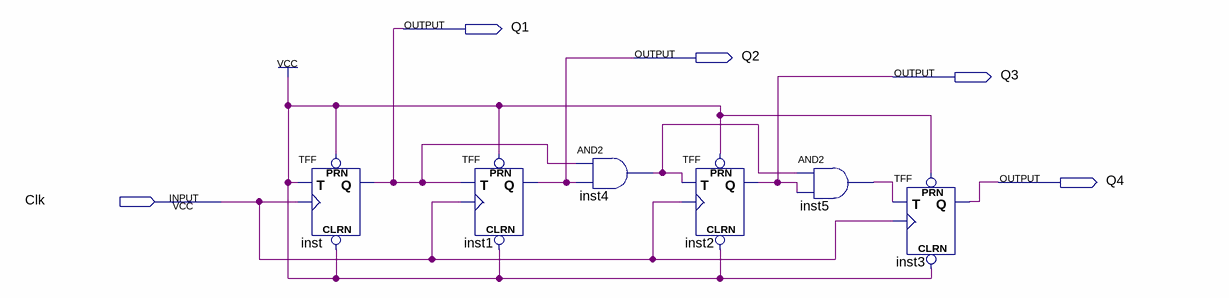
[diagram p0: schematic sheet]
// Quartus schematic lab10step2b.bdf as structural Verilog: 6 symbols, 5 pins
module lab10step2b (
  input  Clk,
  output Q1,
  output Q2,
  output Q3,
  output Q4
);

  wire inst4_out, inst5_out;

  TFF inst (.PRN(1'b1), .CLRN(1'b1), .T(1'b1), .CLK(Clk), .Q(Q1));
  TFF inst1 (.PRN(1'b1), .CLRN(1'b1), .T(Q1), .CLK(Clk), .Q(Q2));
  and inst4 (inst4_out, Q1, Q2);
  TFF inst2 (.PRN(1'b1), .CLRN(1'b1), .T(inst4_out), .CLK(Clk), .Q(Q3));
  and inst5 (inst5_out, inst4_out, Q3);
  TFF inst3 (.PRN(1'b1), .CLRN(1'b1), .T(inst5_out), .CLK(Clk), .Q(Q4));
endmodule
